# EAGLE design board (EAGLE 6.1)
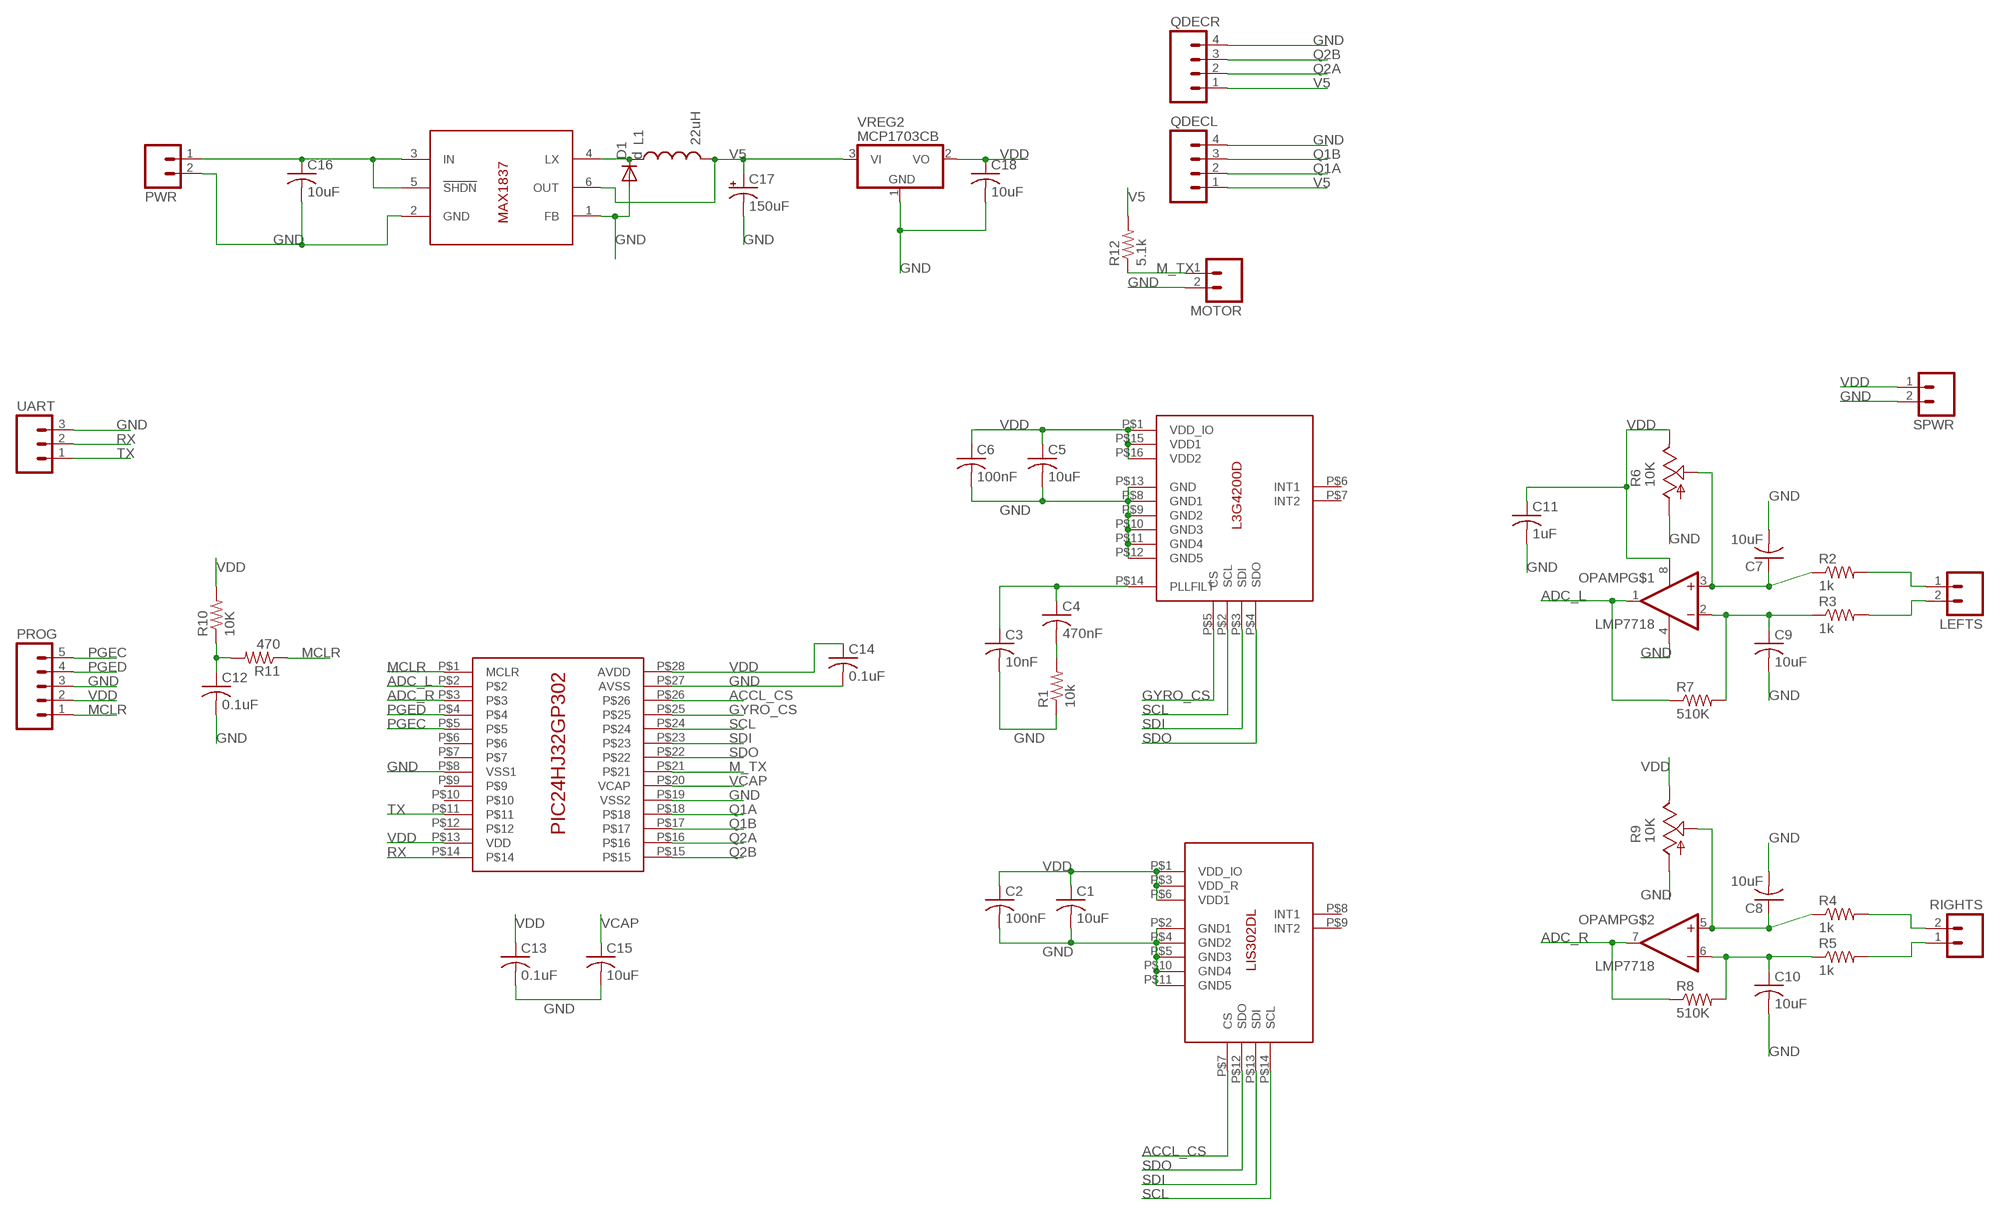
[diagram p0: schematic, sheet 1]

## Parts
C1  10uF  C-USC0805  [C0805]
C2  100nF  C-USC0805  [C0805]
C3  10nF  C-USC0805  [C0805]
C4  470nF  C-USC0805  [C0805]
C5  10uF  C-USC0805  [C0805]
C6  100nF  C-USC0805  [C0805]
C7  10uF  C-USC1206  [C1206]
C8  10uF  C-USC1206  [C1206]
C9  10uF  C-USC1206  [C1206]
C10  10uF  C-USC1206  [C1206]
C11  1uF  C-USC0805  [C0805]
C12  0.1uF  C-USC0805  [C0805]
C13  0.1uF  C-USC0805  [C0805]
C14  0.1uF  C-USC0805  [C0805]
C15  10uF  C-USC0805  [C0805]
C16  10uF  C-USC1206  [C1206]
C17  150uF  CPOL-USCT3528  [CT3528]
C18  10uF  C-USC0805  [C0805]
D1  d  DIODESOD  [SOD-323]
L1  22uH  INDUCTOR1007  [1007]
LEFTS  M02POLAR  [MOLEX-1X2]
MOTOR  M02POLAR  [MOLEX-1X2]
OPAMP  LMP7718  [SO08]
PROG  M05PTH  [1X05]
PWR  M02POLAR  [MOLEX-1X2]
QDECL  M04POLAR  [MOLEX-1X4]
QDECR  M04POLAR  [MOLEX-1X4]
R1  10k  R-US_R0805  [R0805]
R2  1k  R-US_R1206  [R1206]
R3  1k  R-US_R1206  [R1206]
R4  1k  R-US_R1206  [R1206]
R5  1k  R-US_R1206  [R1206]
R6  10K  TRIM_US-RJ6S  [RJ6S]
R7  510K  R-US_R0805  [R0805]
R8  510K  R-US_R0805  [R0805]
R9  10K  TRIM_US-RJ6S  [RJ6S]
R10  10K  R-US_R0805  [R0805]
R11  470  R-US_R0805  [R0805]
R12  5.1k  R-US_R0805  [R0805]
RIGHTS  M02POLAR  [MOLEX-1X2]
SPWR  M02POLAR  [MOLEX-1X2]
U$1  PIC24HJ32GP302  [SOIC-28]
U$2  L3G4200D  [LGA-16]
U$3  LIS302DL  [LGA-14]
UART  M03PTH  [1X03]
VREG1  MAX1837  [SOT23-6L]
VREG2  MCP1703CB  [SOT23]

## Nets
ACCL_CS: U$1.P$26 U$3.P$7(CS)
ADC_L: OPAMP.1(OUT) R7.1 U$1.P$2
ADC_R: OPAMP.7(OUT) R8.1 U$1.P$3
GND: C1.2 C2.2 C3.2 C5.2 C6.2 C7.2 C8.2 C9.2 C10.2 C11.2 C12.2 C13.2 C14.2 C15.2 C16.2 C17.- C18.2 D1.2(A) MOTOR.2 OPAMP.4(V-) PROG.3 PWR.2 QDECL.4 QDECR.4 R1.1 R6.A R9.A SPWR.2 U$1.P$8(VSS1) U$1.P$19(VSS2) U$1.P$27(AVSS) U$2.P$8(GND1) U$2.P$9(GND2) U$2.P$10(GND3) U$2.P$11(GND4) U$2.P$12(GND5) U$2.P$13(GND) U$3.P$2(GND1) U$3.P$4(GND2) U$3.P$5(GND3) U$3.P$10(GND4) U$3.P$11(GND5) UART.3 VREG1.1(FB) VREG1.2(GND) VREG2.1(GND)
GYRO_CS: U$1.P$25 U$2.P$5(CS)
M_TX: MOTOR.1 R12.1 U$1.P$21
MCLR: PROG.1 R11.1 U$1.P$1(MCLR)
N$1: C16.1 PWR.1 VREG1.3(IN) VREG1.5(!SHDN)
N$3: R4.2 RIGHTS.2
N$4: C3.1 C4.1 U$2.P$14(PLLFILT)
N$5: C4.2 R1.2
N$6: C7.1 OPAMP.3(+IN) R2.1 R6.S
N$7: C9.1 OPAMP.2(-IN) R3.1 R7.2
N$8: C10.1 OPAMP.6(-IN) R5.1 R8.2
N$9: LEFTS.1 R2.2
N$10: LEFTS.2 R3.2
N$11: R5.2 RIGHTS.1
N$12: C8.1 OPAMP.5(+IN) R4.1 R9.S
N$13: D1.1(C) L1.1 VREG1.4(LX)
N$15: C12.1 R10.1 R11.2
PGEC: PROG.5 U$1.P$5
PGED: PROG.4 U$1.P$4
Q1A: QDECL.2 U$1.P$18
Q1B: QDECL.3 U$1.P$17
Q2A: QDECR.2 U$1.P$16
Q2B: QDECR.3 U$1.P$15
RX: U$1.P$14 UART.2
SCL: U$1.P$24 U$2.P$2(SCL) U$3.P$14(SCL)
SDI: U$1.P$23 U$2.P$3(SDI) U$3.P$13(SDI)
SDO: U$1.P$22 U$2.P$4(SDO) U$3.P$12(SDO)
TX: U$1.P$11 UART.1
V5: C17.+ L1.2 QDECL.1 QDECR.1 R12.2 VREG1.6(OUT) VREG2.3(VI)
VCAP: C15.1 U$1.P$20(VCAP)
VDD: C1.1 C2.1 C5.1 C6.1 C11.1 C13.1 C14.1 C18.1 OPAMP.8(V+) PROG.2 R6.E R9.E R10.2 SPWR.1 U$1.P$13(VDD) U$1.P$28(AVDD) U$2.P$1(VDD_IO) U$2.P$15(VDD1) U$2.P$16(VDD2) U$3.P$1(VDD_IO) U$3.P$3(VDD_R) U$3.P$6(VDD1) VREG2.2(VO)
Unconnected: U$1.P$6 U$1.P$7 U$1.P$9 U$1.P$10 U$1.P$12 U$2.P$6(INT1) U$2.P$7(INT2) U$3.P$8(INT1) U$3.P$9(INT2)

## Library data of the parts
C1-C16 C18 = rcl:C-US: CAPACITOR, American symbol
C17 = rcl:CPOL-US: POLARIZED CAPACITOR, American symbol
D1 = SparkFun:DIODE: Diode These are standard reverse protection diodes and small signal diodes. SMA package can handle up to about 1A. SOD-323 can handle about 200mA. What the SOD-323 package when ordering, there are some mfgs out there that are 5-pin packages.
L1 = SparkFun:INDUCTOR: Inductors Basic Inductor/Choke - 0603 and 1206. Footprints are not proven and vary greatly between part numbers.
LEFTS MOTOR PWR RIGHTS SPWR = SparkFun:M02: Header 2 Standard 2-pin 0.1" header. Use with straight break away headers (SKU : PRT-00116), right angle break away headers (PRT-00553), swiss pins (PRT-00743), machine pins (PRT-00117), and female headers (PRT-00115). Molex polarized connector foot print use with SKU : PRT-08233 with associated crimp pins and housings.
OPAMP = custom:LMP7718
PROG = SparkFun:M05: Header 5 Standard 5-pin 0.1" header. Use with straight break away headers (SKU : PRT-00116), right angle break away headers (PRT-00553), swiss pins (PRT-00743), machine pins (PRT-00117), and female headers (PRT-00115). Molex polarized connector foot print use with SKU : PRT-08230 with associated crimp pins and housings.
QDECL QDECR = SparkFun:M04: Header 4 Standard 4-pin 0.1" header. Use with straight break away headers (SKU : PRT-00116), right angle break away headers (PRT-00553), swiss pins (PRT-00743), machine pins (PRT-00117), and female headers (PRT-00115). Molex polarized connector foot print use with SKU : PRT-08231 with associated crimp pins and housings. 1MM SMD Version SKU: PRT-10208
R1-R5 R7 R8 R10-R12 = rcl:R-US_: RESISTOR, American symbol
R6 R9 = pot:TRIM_US-: POTENTIOMETER
U$1 = custom:PIC24HJ32GP302
U$2 = custom:L3G4200D
U$3 = custom:LIS302DL
UART = SparkFun:M03: Header 3 Standard 3-pin 0.1" header. Use with straight break away headers (SKU : PRT-00116), right angle break away headers (PRT-00553), swiss pins (PRT-00743), machine pins (PRT-00117), and female headers (PRT-00115). Molex polarized connector foot print use with SKU : PRT-08232 with associated crimp pins and housings.
VREG1 = custom:MAX1837
VREG2 = linear:MCP1703: 250 mA, 16V, Low Quiescent Current LDO Regulator Source: http://ww1.microchip.com/downloads/en/DeviceDoc/22049b.pdf

## Board
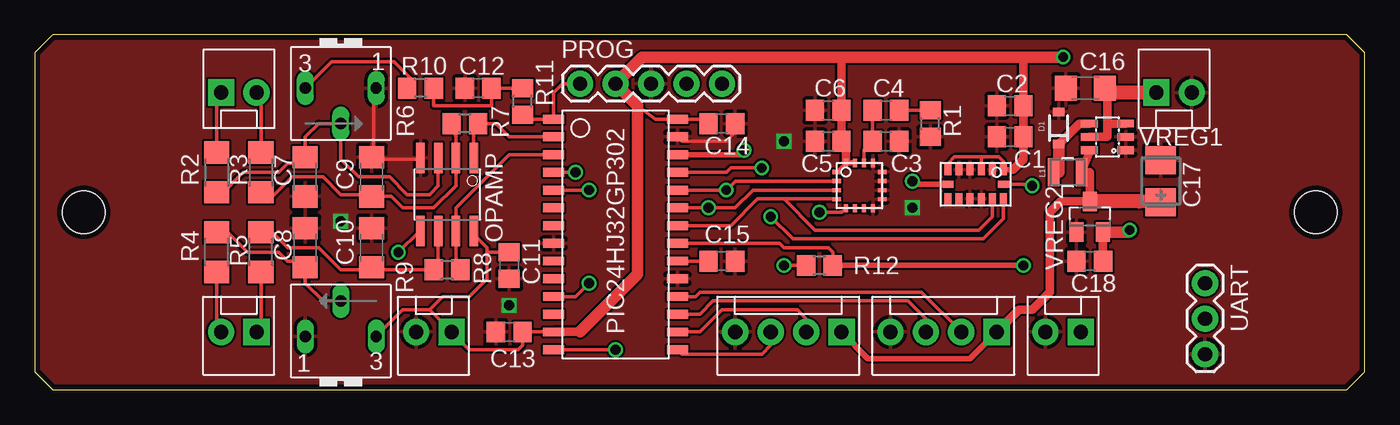
[diagram p1: board, top side]
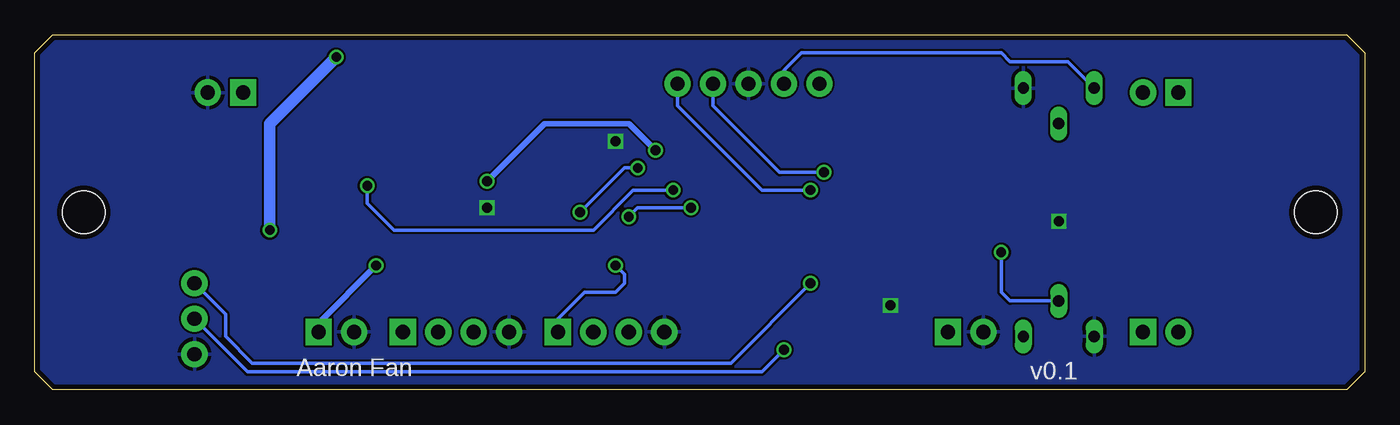
[diagram p2: board, bottom side, seen from below]

Size 95.25 x 25.4 mm. Coordinates in mm from the lower left corner, seen from the top.
Outline: 93.98,25.4 1.27,25.4 0,24.13 0,1.27 1.27,0 93.98,0 95.25,1.27 95.25,24.13 93.98,25.4
Copper layers (1*16): Top 0.0356mm / dielectric 1.5011mm / Bottom 0.0356mm
Design rules: minimum track width 6mil, minimum drill 13mil, track to track 6mil, track to pad 6mil, pad to pad 6mil, via to via 6mil, smd to smd 6mil, copper to edge 15mil, drill to drill 6mil, minimum pad ring 7mil, minimum via ring 7mil, stop-mask expansion 4mil, vias tented up to drill 28mil, thermal gap 10mil
Holes 3.05 mm at 3.49,12.7 91.76,12.7

### Footprints (pad centres in the part's own frame; a part is rotated, then mirrored left to right if it is on the bottom)
C0805 = smd 1.3 x 1.5: 1 -0.95,0; 2 0.95,0
C1206 = smd 1.6 x 1.8: 1 -1.4,0; 2 1.4,0
CT3528 = smd 2 x 2.2: + -1.5,0; - 1.5,0
SOD-323 = smd 0.63 x 0.83: 1 -1.15,0; 2 1.15,0
1007 = smd 2 x 0.8: 1 0,1; 2 0,-1
MOLEX-1X2 = drill 1.016 pad 1.88 square: 1 0,0 | drill 1.016 pad 1.88: 2 2.54,0
SO08 = smd 0.61 x 2.21: 1 -1.905,-2.616; 2 -0.635,-2.616; 3 0.635,-2.616; 4 1.905,-2.616; 5 1.905,2.616; 6 0.635,2.616; 7 -0.635,2.616; 8 -1.905,2.616
1X05 = drill 1.016 pad 1.88: 1 0,0; 2 2.54,0; 3 5.08,0; 4 7.62,0; 5 10.16,0
MOLEX-1X4 = drill 1.016 pad 1.88 square: 1 0,0 | drill 1.016 pad 1.88: 2 2.54,0; 3 5.08,0; 4 7.62,0
R0805 = smd 1.3 x 1.5: 1 -0.95,0; 2 0.95,0
R1206 = smd 1.6 x 1.803: 1 -1.422,0; 2 1.422,0
RJ6S = drill 0.813 long: A 2.54,0; E -2.54,0; S 0,-2.54
SOIC-28 = smd 0.635 x 1.524: P$1 -8.89,-3.81; P$2 -7.62,-3.81; P$3 -6.35,-3.81; P$4 -5.08,-3.81; P$5 -3.81,-3.81; P$6 -2.54,-3.81; P$7 -1.27,-3.81; P$8 0,-3.81; P$9 1.27,-3.81; P$10 2.54,-3.81; P$11 3.81,-3.81; P$12 5.08,-3.81; P$13 6.35,-3.81; P$14 7.62,-3.81; P$15 7.62,5.08; P$16 6.35,5.08; P$17 5.08,5.08; P$18 3.81,5.08; P$19 2.54,5.08; P$20 1.27,5.08; P$21 0,5.08; P$22 -1.27,5.08; P$23 -2.54,5.08; P$24 -3.81,5.08; P$25 -5.08,5.08; P$26 -6.35,5.08; P$27 -7.62,5.08; P$28 -8.89,5.08
LGA-16 = smd 0.6 x 0.3: P$1 -1.3,1.3; P$2 -1.3,0.65; P$3 -1.3,0; P$4 -1.3,-0.65; P$9 1.95,-0.65; P$10 1.95,0; P$11 1.95,0.65; P$12 1.95,1.3 | smd 0.3 x 0.6: P$5 -0.65,-1.3; P$6 0,-1.3; P$7 0.65,-1.3; P$8 1.3,-1.3; P$13 1.3,1.95; P$14 0.65,1.95; P$15 0,1.95; P$16 -0.65,1.95
LGA-14 = smd 0.5 x 0.8: P$1 2.4,2.1; P$2 1.6,2.1; P$3 0.8,2.1; P$4 0,2.1; P$5 -0.8,2.1; P$6 -1.6,2.1; P$8 -1.6,0; P$9 -0.8,0; P$10 0,0; P$11 0.8,0; P$12 1.6,0; P$13 2.4,0 | smd 0.8 x 0.5: P$7 -1.6,1.05; P$14 2.4,1.05
1X03 = drill 1.016 pad 1.88: 1 0,0; 2 2.54,0; 3 5.08,0
SOT23-6L = smd 0.55 x 1.2: 1 -0.95,-1.3; 2 0,-1.3; 3 0.95,-1.3; 4 0.95,1.3; 5 0,1.3; 6 -0.95,1.3
SOT23 = smd 1 x 1.4: 1 -0.95,-1.1; 2 0.95,-1.1; 3 0,1.1

### Placement (x,y rotation side)
C1  69.85,18.1 180 top
C2  69.85,20.32 180 top
C3  60.96,17.78 0 top
C4  60.96,20 0 top
C5  56.83,17.78 180 top
C6  56.83,20 180 top
C7  19.37,15.24 270 top
C8  19.37,10.16 90 top
C9  24.13,15.24 90 top
C10  24.13,10.16 90 top
C11  33.97,8.89 270 top
C12  31.75,21.59 180 top
C13  33.97,4.13 180 top
C14  49.21,19.05 0 top
C15  49.21,9.21 0 top
C16  75.25,21.59 180 top
C17  80.64,14.92 90 top
C18  75.56,9.21 180 top
D1  73.34,18.73 90 top
L1  73.98,15.56 90 top
LEFTS  13.34,21.27 0 top
MOTOR  74.93,4.13 180 top
OPAMP  29.53,13.97 180 top
PROG  39.05,21.91 0 top
PWR  80.33,21.27 0 top
QDECL  68.9,4.13 180 top
QDECR  57.78,4.13 180 top
R1  64.14,19.05 90 top
R2  13.02,15.56 90 top
R3  16.19,15.56 90 top
R4  13.02,9.84 270 top
R5  16.19,9.84 270 top
R6  21.91,21.59 0 top
R7  30.8,19.05 180 top
R8  29.53,8.57 180 top
R9  21.91,3.81 180 top
R10  27.62,21.59 180 top
R11  34.92,20.64 90 top
R12  56.2,8.89 180 top
RIGHTS  15.88,4.13 180 top
SPWR  29.84,4.13 180 top
U$1  40.96,10.48 270 top
U$2  58.74,14.29 0 top
U$3  66.99,13.65 0 top
UART  83.82,7.62 270 top
VREG1  76.83,18.1 90 top
VREG2  75.56,12.38 0 top

### Tracks (layer width: path | path; a pad name or v marks a point on that pad's centre or on a via)
ACCL_CS  (via drill 0.7)
  Top 0.406: U$1.P$26 50.48,16.83 v50.8,17.14 | U$3.P$7 63.09,14.7 v62.87,14.92
  Bottom 0.406: v50.8,17.14 52.7,19.05 58.74,19.05 v62.87,14.92
ADC_L
  Top 0.254: U$1.P$2 33.97,18.1 33.02,19.05 R7.1 | OPAMP.1 31.43,18.73 R7.1 | R7.1
ADC_R
  Top 0.254: 30.16,7.93 R8.1 30.16,8.89 OPAMP.7 30.16,13.02 33.97,16.83 U$1.P$3
GND  (via drill 0.7)
  Top 0.254: 24,11.43 C10.2 | 27.62,16.51 24.26,16.51 | 24.26,16.51 C9.2 | 24.26,16.51 24.26,21.4 | C11.2 | C14.2 50.16,18.41 49.53,17.78 46.35,17.78 U$1.P$27
  other vias: 33.97,6.03 53.66,17.78 62.87,13.02 21.91,12.06
  pour Bottom: 1.27,25.4 93.98,25.4 95.25,24.13 95.25,1.27 93.98,0 1.27,0 0,1.27 0,24.13
  pour Top: 1.27,25.4 93.98,25.4 95.25,24.13 95.25,1.27 93.98,0 1.27,0 0,1.27 0,24.13
GYRO_CS  (via drill 0.7)
  Top 0.254: v56.2,12.7 57.8,12.7 U$2.P$5 | v52.07,15.88 49.85,15.88 49.53,15.56 U$1.P$25
  Bottom 0.254: v52.07,15.88 53.02,15.88 v56.2,12.7
M_TX  (via drill 0.7)
  Top 0.254: U$1.P$21 53.34,10.48 53.66,10.16 56.83,10.16 57.15,9.84 R12.1
  Top 0.406: v70.8,8.89 R12.1
  Bottom 0.406: MOTOR.1 74.93,4.76 v70.8,8.89
MCLR
  Top 0.254: PROG.1 37.78,21.91 37.15,21.27 U$1.P$1 34.92,19.37 R11.1
N$1
  Top 0.254: C16.1 76.52,21.59 76.83,21.27
  Top 0.61: VREG1.3 76.83,19.05 | 76.83,19.05 76.83,18.1 VREG1.5 | C16.1 76.83,21.27 76.83,19.05
  Top 1.016: PWR.1 76.83,21.27
N$3
  Top 0.254: R4.2 13.02,4.45 RIGHTS.2
N$4
  Top 0.254: U$2.P$14 59.39,17.16 C3.1 C4.1
N$5
  Top 0.254: C4.2 R1.2
N$6
  Top 0.254: R2.1 13.18,13.82 14.92,15.56 17.46,15.56 18.1,16.19 18.92,16.19 C7.1 19.37,18.1 20.32,19.05 R6.S 21.91,16.51 23.18,15.24 25.4,15.24 26.67,13.97 28.26,13.97 28.89,14.61 OPAMP.3
N$7
  Top 0.254: R7.2 30.16,18.1 OPAMP.2 30.16,14.61 28.57,13.02 26.35,13.02 25.53,13.84 C9.1 24,13.97 21.91,13.97 20.64,15.24 18.41,15.24 16.99,13.82 R3.1
N$8
  Top 0.254: R5.1 16.68,11.58 18.1,10.16 20.32,10.16 21.91,8.57 23.94,8.57 C10.1 | C10.1 24.13,8.57 | OPAMP.6 28.89,8.89 R8.2 24.32,8.57 C10.1
N$9
  Top 0.254: R2.2 13.02,20.95 LEFTS.1
N$10
  Top 0.254: R3.2 16.19,20.95 LEFTS.2
N$11
  Top 0.254: R5.2 16.19,4.45 RIGHTS.1
N$12  (via drill 0.7)
  Top 0.254: R4.1 13.5,11.58 15.24,9.84 17.46,9.84 18.1,9.21 18.92,9.21 C8.1 | C8.1 19.37,8.89 | OPAMP.5 27.55,11.35 v26.04,9.84 | R9.S 20.64,6.35 19.37,7.62 C8.1
  Bottom 0.254: R9.S 25.4,6.35 26.04,6.99 v26.04,9.84
N$13
  Top 0.61: VREG1.4 74.81,19.05 D1.1 73.34,17.46
  Top 0.813: L1.1 73.34,15.56 73.34,17.46
N$15
  Top 0.254: R11.2 C12.1 32.7,20.32 28.57,20.32 28.57,21.27 R10.1
PGEC  (via drill 0.7)
  Top 0.254: U$1.P$5 v39.69,14.29
  Bottom 0.254: v39.69,14.29 43.18,14.29 49.21,20.32 PROG.5
PGED  (via drill 0.7)
  Top 0.254: U$1.P$4 v38.73,15.56
  Bottom 0.254: v38.73,15.56 41.91,15.56 46.67,20.32 PROG.4
Q1A
  Top 0.254: U$1.P$18 47.31,6.67 47.62,6.99 63.5,6.99 QDECL.2
Q1B
  Top 0.254: QDECL.3 63.82,5.08 62.55,6.35 48.58,6.35 47.62,5.4 U$1.P$17
Q2A
  Top 0.254: QDECR.2 55.24,5.08 54.61,5.71 49.21,5.71 47.62,4.13 U$1.P$16
Q2B
  Top 0.254: QDECR.3 52.7,3.17 52.07,2.54 46.35,2.54 U$1.P$15
RX  (via drill 0.7)
  Top 0.254: v41.59,2.86 U$1.P$14
  Bottom 0.254: UART.2 80.01,1.27 43.18,1.27 v41.59,2.86
SCL  (via drill 0.7)
  Top 0.254: U$3.P$14 71.34,14.7 v71.44,14.61 | U$1.P$24 v49.53,14.29 50.18,14.94 U$2.P$2
  Bottom 0.254: v71.44,14.61 71.44,13.34 69.53,11.43 55.24,11.43 52.39,14.29 v49.53,14.29
SDI  (via drill 0.7)
  Top 0.254: U$1.P$23 v48.26,13.02 50.16,13.02 51.44,14.29 U$2.P$3 57.47,14.29 | U$3.P$13 69.39,12.24 67.94,10.79 54.29,10.79 v52.7,12.38
  Bottom 0.254: v52.7,12.38 52.07,13.02 v48.26,13.02
SDO
  Top 0.254: 53.66,13.65 51.75,13.65 49.85,11.75 U$1.P$22 | 53.66,13.65 57.42,13.65 U$2.P$4 | U$3.P$12 68.59,12.39 67.63,11.43 55.88,11.43 53.66,13.65
TX  (via drill 0.7)
  Top 0.254: v39.69,7.62 38.73,6.67 U$1.P$11
  Bottom 0.254: UART.1 81.6,5.4 81.6,3.81 79.69,1.91 45.4,1.91 v39.69,7.62
V5  (via drill 0.7)
  Top 0.254: v53.66,8.89 R12.2
  Top 0.406: QDECL.1 66.99,2.22 59.69,2.22 QDECR.1
  Top 0.61: VREG1.6 75.61,17.15 L1.2 75.56,15.56 VREG2.3 73.49,13.48 72.71,12.7 72.71,6.99 71.44,5.71 70.48,5.71 QDECL.1
  Top 1.016: C17.+ 79.14,13.48 VREG2.3
  Bottom 0.254: QDECR.1 57.78,5.08 55.88,6.99 53.66,6.99 53.02,7.62 53.02,8.26 v53.66,8.89
VCAP
  Top 0.254: C15.1 U$1.P$20
VDD  (via drill 0.7)
  Top 0.254: C11.1 32.39,9.84 32.38,9.84 | 31.43,11.43 OPAMP.8 31.43,11.11 32.38,10.16 32.38,9.84 | 28.26,5.71 29.21,6.67 31.11,6.67 32.38,7.94 32.38,9.84 | R10.2 26.99,22.22 25.72,23.5 21.27,23.5 R6.E | 48.26,19.37 U$1.P$28 44.45,19.37 43.18,20.32 | U$1.P$13 C13.1 34.92,3.17 34.61,2.86 31.11,2.86 SPWR.1 28.26,5.71 | 70.8,17.78 C1.1 | U$3.P$3 67.79,16.34 67.79,16.67 | 67.79,16.67 65.88,16.67 65.39,16.18 U$3.P$6 | R9.E 26.35,5.71 28.26,5.71 | 67.79,16.67 69.06,16.67 69.37,16.35 69.37,15.73 | 69.37,15.72 69.37,15.73 | 69.37,15.73 U$3.P$1 | U$2.P$1 U$2.P$16 | 58.09,17.48 C5.1 C6.1 | 76.52,8.89 C18.1
  Top 0.406: U$3.P$1 70.05,15.75 | U$2.P$15 U$2.P$16
  Top 0.61: 70.05,15.75 70.8,16.51 70.8,17.78 | C18.1 76.52,11.11 | 76.52,11.11 | U$2.P$16 58.09,17.48 | C14.1 48.26,19.36 48.26,19.37 | 39.05,4.13 U$1.P$13 | 71.12,23.81 70.8,23.49 C2.1 C1.1 | C5.1 57.78,23.81 | VREG2.2 76.52,11.11 | C1.1 | C1.1
  Top 0.813: 39.05,4.13 43.18,8.26 43.18,20.32 PROG.2 43.5,23.81 57.78,23.81 71.12,23.81 v73.66,23.81 | VREG2.2 78.28,11.28 v78.42,11.43
  Bottom 0.254: R6.E 21.27,23.5 25.4,23.5 26.04,24.13 40.32,24.13 41.59,22.86 PROG.2
  Bottom 0.813: v78.42,11.43 78.42,19.05 v73.66,23.81

### Text on the board
bPlace: v0.1 | Aaron Fan